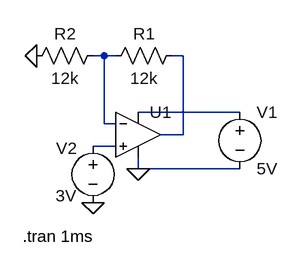
[diagram p0: schematic amplifier.asc]
amplifier.asc, the LTspice schematic file:
Version 4
SHEET 1 880 680
WIRE 160 32 144 32
WIRE 176 32 160 32
WIRE 272 32 256 32
WIRE 352 112 208 112
WIRE 160 128 160 32
WIRE 176 128 160 128
WIRE 272 144 272 32
WIRE 272 144 240 144
WIRE 176 160 144 160
WIRE 208 192 208 176
WIRE 352 192 208 192
FLAG 64 32 0
FLAG 208 192 0
FLAG 144 240 0
SYMBOL Opamps\\UniversalOpamp2 208 144 R0
SYMATTR InstName U1
SYMBOL res 272 16 R90
WINDOW 0 0 56 VBottom 2
WINDOW 3 32 56 VTop 2
SYMATTR InstName R1
SYMATTR Value 12k
SYMBOL res 160 16 R90
WINDOW 0 0 56 VBottom 2
WINDOW 3 32 56 VTop 2
SYMATTR InstName R2
SYMATTR Value 12k
SYMBOL voltage 352 96 R0
WINDOW 123 0 0 Left 2
WINDOW 39 0 0 Left 2
SYMATTR InstName V1
SYMATTR Value 5V
SYMBOL voltage 144 144 R0
WINDOW 0 -52 19 Left 2
WINDOW 3 -53 86 Left 2
WINDOW 123 0 0 Left 2
WINDOW 39 0 0 Left 2
SYMATTR InstName V2
SYMATTR Value 3V
TEXT 44 288 Left 2 !.tran 1ms

The netlist it stands for:
* amplifier.asc
XU1 N004 N001 N003 0 N002 level.2 Avol=1Meg GBW=10Meg Slew=10Meg ilimit=25m rail=0 Vos=0 phimargin=45 en=0 enk=0 in=0 ink=0 Rin=500Meg  ; pins IN+ IN- V+ V- OUT
R1 N002 N001 12k
R2 N001 0 12k
V1 N003 0 5V
V2 N004 0 3V
.tran 1ms
.lib UniversalOpamps2.sub
.backanno
.end